# EAGLE design base (EAGLE 5.10)
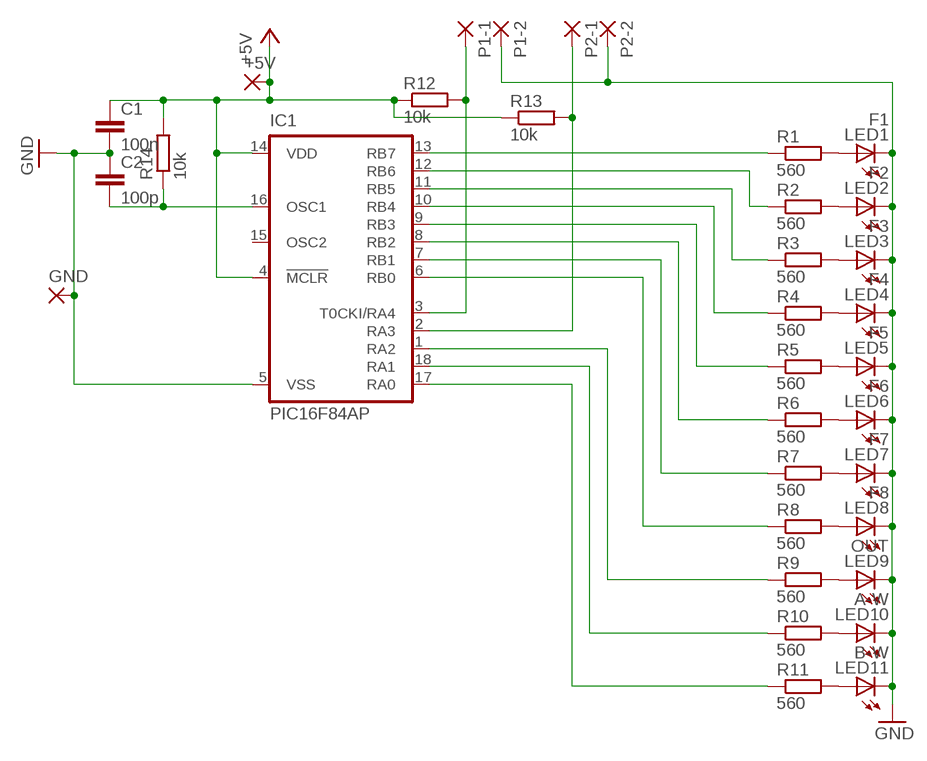
[diagram p0: schematic, sheet 1]

## Parts
+5V  2,54/1,0  [2,54/1,0]
C1  100n  C-EU050-025X075  [C050-025X075]
C2  100p  C-EU050-025X075  [C050-025X075]
GND  2,54/1,0  [2,54/1,0]
IC1  PIC16F84AP  [DIL18]
LED1  F1  LED5MM  [LED5MM]
LED2  F2  LED5MM  [LED5MM]
LED3  F3  LED5MM  [LED5MM]
LED4  F4  LED5MM  [LED5MM]
LED5  F5  LED5MM  [LED5MM]
LED6  F6  LED5MM  [LED5MM]
LED7  F7  LED5MM  [LED5MM]
LED8  F8  LED5MM  [LED5MM]
LED9  OUT  LED5MM  [LED5MM]
LED10  A-W  LED5MM  [LED5MM]
LED11  B-W  LED5MM  [LED5MM]
P1-1  WIREPAD2,54/1,0  [2,54/1,0]
P1-2  WIREPAD2,54/1,0  [2,54/1,0]
P2-1  WIREPAD2,54/1,0  [2,54/1,0]
P2-2  WIREPAD2,54/1,0  [2,54/1,0]
R1  560  R-EU_0204/2V  [0204V]
R2  560  R-EU_0204/2V  [0204V]
R3  560  R-EU_0204/2V  [0204V]
R4  560  R-EU_0204/2V  [0204V]
R5  560  R-EU_0204/2V  [0204V]
R6  560  R-EU_0204/2V  [0204V]
R7  560  R-EU_0204/2V  [0204V]
R8  560  R-EU_0204/2V  [0204V]
R9  560  R-EU_0207/7  [0207/7]
R10  560  R-EU_0207/7  [0207/7]
R11  560  R-EU_0207/7  [0207/7]
R12  10k  R-EU_0204/2V  [0204V]
R13  10k  R-EU_0204/2V  [0204V]
R14  10k  R-EU_0204/2V  [0204V]

## Nets
+5V: +5V.1(P) C1.1 IC1.4(!MCLR) IC1.14(VDD) R12.1 R13.1 R14.2
GND: C1.2 C2.1 GND.1(P) IC1.5(VSS) LED1.K(C) LED2.K(C) LED3.K(C) LED4.K(C) LED5.K(C) LED6.K(C) LED7.K(C) LED8.K(C) LED9.K(C) LED10.K(C) LED11.K(C) P1-2.1(P) P2-2.1(P)
N$1: LED1.A R1.2
N$2: LED2.A R2.2
N$3: LED3.A R3.2
N$4: LED4.A R4.2
N$5: LED5.A R5.2
N$6: LED6.A R6.2
N$7: LED7.A R7.2
N$8: LED8.A R8.2
N$9: LED11.A R11.2
N$10: IC1.13(RB7) R1.1
N$11: IC1.12(RB6) R2.1
N$12: IC1.11(RB5) R3.1
N$13: IC1.10(RB4) R4.1
N$14: IC1.9(RB3) R5.1
N$15: IC1.8(RB2) R6.1
N$16: IC1.7(RB1) R7.1
N$17: IC1.6(RB0) R8.1
N$18: LED9.A R9.2
N$19: LED10.A R10.2
N$20: IC1.1(RA2) R9.1
N$21: IC1.18(RA1) R10.1
N$22: C2.2 IC1.16(OSC1) R14.1
N$23: IC1.17(RA0) R11.1
N$24: IC1.3(T0CKI/RA4) P1-1.1(P) R12.2
N$25: IC1.2(RA3) P2-1.1(P) R13.2
Unconnected: IC1.15(OSC2)

## Library data of the parts
+5V GND = wirepad:2,54/1,0: THROUGH-HOLE PAD
C1 C2 = resistor:C-EU: CAPACITOR, European symbol
IC1 = microchip:PIC16F8*: MICROCONTROLLER 8-Bit PIC16F8X Family - CMOS Flash/EEPROM Pin Compatible : PIC16F83, PIC16CR83, PIC16F84A, PIC16CR84 see also PIC16C*
LED1-LED11 = led:LED: LED OSRAM: - CHIPLED LG R971, LG N971, LY N971, LG Q971, LY Q971, LO R971, LY R971 LH N974, LH R974 LS Q976, LO Q976, LY Q976 LO Q996 - Hyper CHIPLED LW Q18S LB Q993, LB Q99A, LB R99A - SideLED LS A670, LO A670, LY A670, LG A670, LP A670 LB A673, LV A673, LT A673, LW A673 LH A674 LY A675 LS A676, LA A676, LO A676, LY A676, LW A676 LS A679, LY A679, LG A679 - Hyper Micro SIDELED® LS Y876, LA Y876, LO Y876, LY Y876 LT Y87S - SmartLED LW L88C, LW L88S LB L89C, LB L89S, LG L890 LS L89K, LO L89K, LY L89K LS L896, LA L896, LO L896, LY L896 - TOPLED LS T670, LO T670, LY T670, LG T670, LP T670 LSG T670, LSP T670, LSY T670, LOP T670, LYG T670 LG T671, LOG T671, LSG T671 LB T673, LV T673, LT T673, LW T673 LH T674 LS T676, LA T676, LO T676, LY T676, LB T676, LH T676, LSB T676, LW T676 LB T67C, LV T67C, LT T67C, LS T67K, LO T67K, LY T67K, LW E67C LS E67B, LA E67B, LO E67B, LY E67B, LB E67C, LV E67C, LT E67C LW T67C LS T679, LY T679, LG T679 LS T770, LO T770, LY T770, LG T770, LP T770 LB T773, LV T773, LT T773, LW T773 LH T774 LS E675, LA E675, LY E675, LS T675 LS T776, LA T776, LO T776, LY T776, LB T776 LHGB T686 LT T68C, LB T68C - Hyper Mini TOPLED® LB M676 - Mini TOPLED Santana® LG M470 LS M47K, LO M47K, LY M47K Source: http://www.osram.convergy.de LUXEON: - LUMILED® LXK2-PW12-R00, LXK2-PW12-S00, LXK2-PW14-U00, LXK2-PW14-V00 LXK2-PM12-R00, LXK2-PM12-S00, LXK2-PM14-U00 LXK2-PE12-Q00, LXK2-PE12-R00, LXK2-PE12-S00, LXK2-PE14-T00, LXK2-PE14-U00 LXK2-PB12-K00, LXK2-PB12-L00, LXK2-PB12-M00, LXK2-PB14-N00, LXK2-PB14-P00, LXK2-PB14-Q00 LXK2-PR12-L00, LXK2-PR12-M00, LXK2-PR14-Q00, LXK2-PR14-R00 LXK2-PD12-Q00, LXK2-PD12-R00, LXK2-PD12-S00 LXK2-PH12-R00, LXK2-PH12-S00 LXK2-PL12-P00, LXK2-PL12-Q00, LXK2-PL12-R00 Source: www.luxeon.com KINGBRIGHT: KA-3528ASYC Source: www.kingbright.com
P1-1 P1-2 P2-1 P2-2 = wirepad:WIREPAD: Wire PAD connect wire on PCB
R1-R8 = resistor:R-EU_: RESISTOR, European symbol
R9-R14 = rcl:R-EU_: RESISTOR, European symbol

## Board
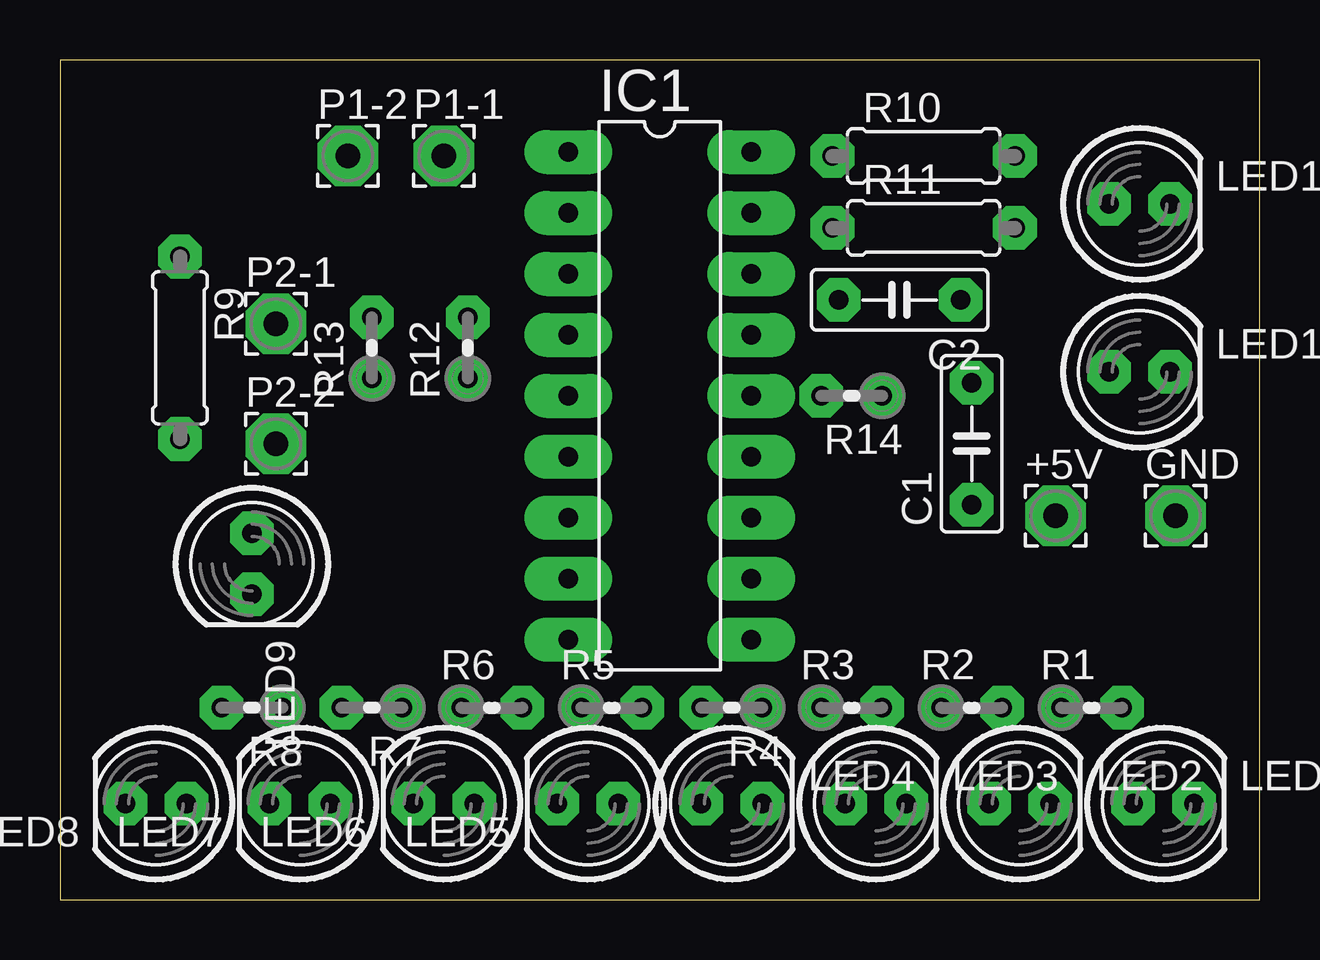
[diagram p1: board, top side]
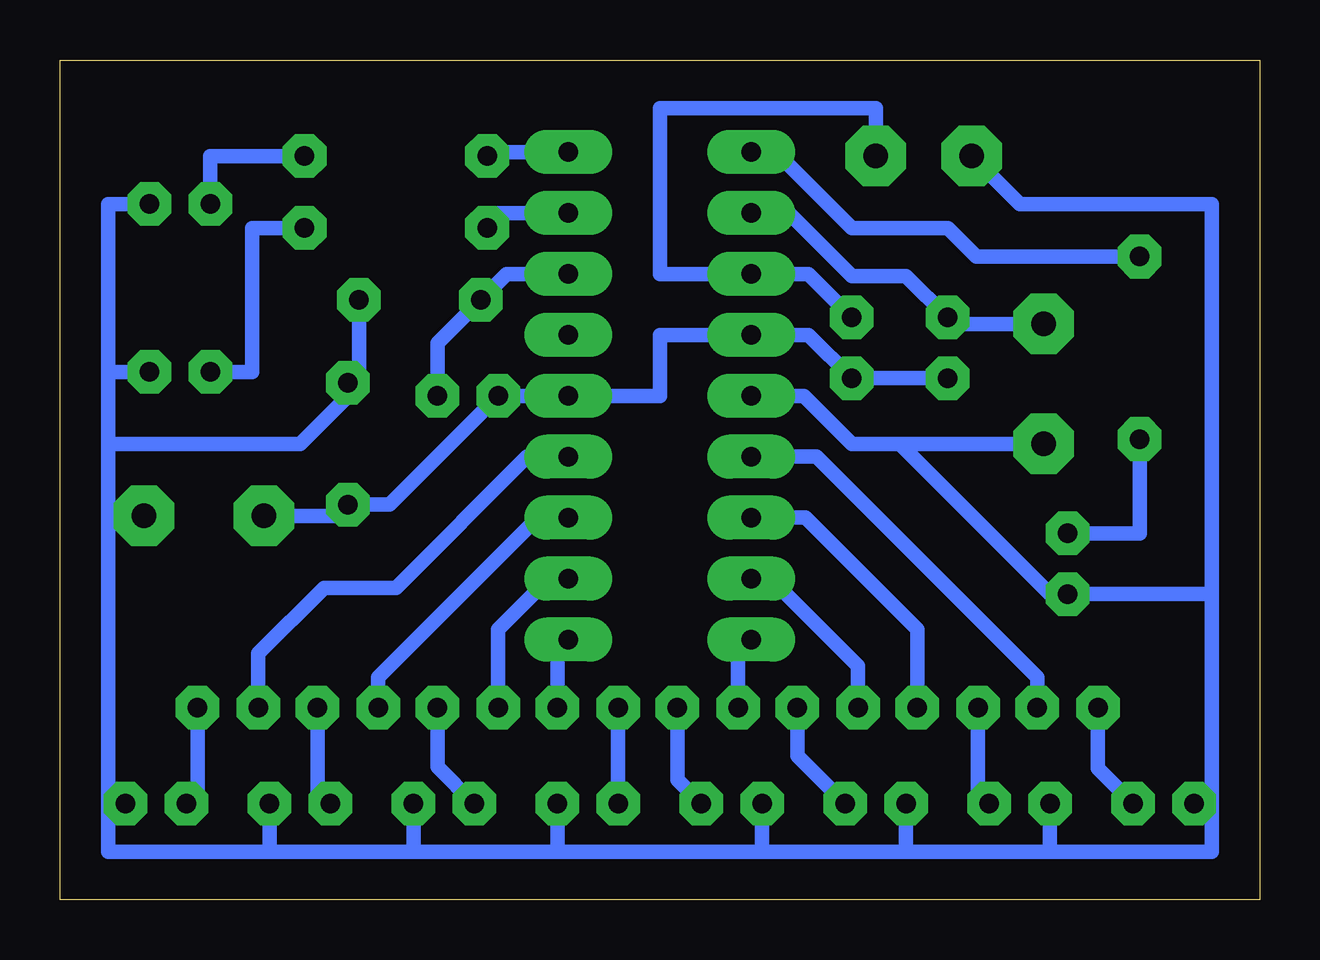
[diagram p2: board, bottom side, seen from below]

Size 50 x 35 mm. Coordinates in mm from the lower left corner, seen from the top.
Outline: 0,0 50,0 50,35 0,35 0,0
Copper layers (1*16): Top 0.035mm / dielectric 1.5mm / Bottom 0.035mm
Design rules "default *": minimum track width 10mil, minimum drill 24mil, track to track 8mil, track to pad 8mil, pad to pad 8mil, via to via 8mil, smd to smd 8mil, copper to edge 40mil, drill to drill 8mil, minimum pad ring 20mil, minimum via ring 8mil, stop-mask expansion 4mil, vias tented up to drill 0mil, thermal gap 10mil

### Footprints (pad centres in the part's own frame; a part is rotated, then mirrored left to right if it is on the bottom)
2,54/1,0 = drill 1.016 pad 2.54 octagon: 1 0,0
C050-025X075 = drill 0.813 octagon: 1 -2.54,0; 2 2.54,0
DIL18 = drill 0.813 long: 1 -10.16,-3.81; 2 -7.62,-3.81; 3 -5.08,-3.81; 4 -2.54,-3.81; 5 0,-3.81; 6 2.54,-3.81; 7 5.08,-3.81; 8 7.62,-3.81; 9 10.16,-3.81; 10 10.16,3.81; 11 7.62,3.81; 12 5.08,3.81; 13 2.54,3.81; 14 0,3.81; 15 -2.54,3.81; 16 -5.08,3.81; 17 -7.62,3.81; 18 -10.16,3.81
LED5MM = drill 0.813 octagon: A -1.27,0; K 1.27,0
0204V = drill 0.813 octagon: 1 -1.27,0; 2 1.27,0
0207/7 = drill 0.813 octagon: 1 -3.81,0; 2 3.81,0

### Placement (x,y rotation side)
+5V  41.5,16 0 top
C1  38,19 90 top
C2  35,25 180 top
GND  46.5,16 0 top
IC1  25,21 270 top
LED1  46,4 0 top
LED2  40,4 0 top
LED3  34,4 0 top
LED4  28,4 0 top
LED5  22,4 180 top
LED6  16,4 180 top
LED7  10,4 180 top
LED8  4,4 180 top
LED9  8,14 270 top
LED10  45,29 0 top
LED11  45,22 0 top
P1-1  16,31 0 top
P1-2  12,31 0 top
P2-1  9,24 0 top
P2-2  9,19 0 top
R1  43,8 0 top
R2  38,8 0 top
R3  33,8 0 top
R4  28,8 180 top
R5  23,8 0 top
R6  18,8 0 top
R7  13,8 180 top
R8  8,8 180 top
R9  5,23 270 top
R10  36,31 0 top
R11  36,28 0 top
R12  17,23 90 top
R13  13,23 90 top
R14  33,21 180 top

### Tracks (layer width: path | path; a pad name or v marks a point on that pad's centre or on a via)
+5V
  Bottom 0.61: R13.1 R12.1 18.81,23.54 IC1.4 25,23.54 25,21 IC1.14 R14.2 36.27,16.46 C1.1 38.46,16 +5V.1
GND
  Bottom 0.61: 8.73,2 2,2 2,4 | 35.27,2 41.27,2 | 48,4 48,2 41.27,2 | 48,4 48,16 | 48,4 LED1.K | 8.73,2 LED7.K | 8.73,2 14.73,2 | 14.73,2 LED6.K | 14.73,2 20.73,2 | 20.73,2 LED5.K | 29.27,2 LED4.K | 20.73,2 29.27,2 | 35.27,2 LED3.K | 29.27,2 35.27,2 | 41.27,2 LED2.K | 48,16 GND.1 | 48,16 48,19 | 48,19 48,22 | 48,22 LED11.K | 48,22 48,29 LED10.K | 2,4 LED8.K | 2,12.73 LED9.K 8.73,12.73 15,19 | 2,4 2,12.73 | 2,12.73 2,29 10,29 P1-2.1 | 15,19 P2-2.1 | 15,19 17,19 19,21 IC1.5 | 48,19 40,19 38,21 C1.2 37.54,22 C2.1
N$1
  Bottom 0.61: R1.2 44.27,4.46 LED1.A
N$2
  Bottom 0.61: R2.2 39.27,4.54 LED2.A
N$3
  Bottom 0.61: R3.2 34.27,5.54 LED3.A
N$4
  Bottom 0.61: R4.2 LED4.A
N$5
  Bottom 0.61: R5.2 24.27,5 LED5.A
N$6
  Bottom 0.61: R6.2 19.27,6 LED6.A
N$7
  Bottom 0.61: R7.2 11.73,4.46 LED7.A
N$8
  Bottom 0.61: R8.2 6.73,5.46 LED8.A
N$9
  Bottom 0.61: R11.2 42,28 42,22 LED11.A
N$10
  Bottom 0.61: IC1.13 30.54,18.46 36,13 39,13 41.73,10.27 R1.1
N$11
  Bottom 0.61: IC1.12 30.08,15.92 36.73,9.27 R2.1
N$12
  Bottom 0.61: IC1.11 29.62,13.38 31.73,11.27 R3.1
N$13
  Bottom 0.61: IC1.10 29.27,10.38 R4.1
N$14
  Bottom 0.61: R5.1 21.73,10.3 IC1.9
N$15
  Bottom 0.61: R6.1 16.73,9.73 20,13 20.81,13 IC1.8
N$16
  Bottom 0.61: R7.1 14.27,11.27 18.92,15.92 IC1.7
N$17
  Bottom 0.61: R8.1 9.27,9.27 18.46,18.46 IC1.6
N$18
  Bottom 0.61: LED9.A 5,15.27 R9.2
N$19
  Bottom 0.61: R10.2 43.73,31 LED10.A
N$20
  Bottom 0.61: R9.1 11.81,26.81 13,28 17,28 20,31 21.03,31 IC1.1
N$21
  Bottom 0.61: R10.1 32.19,31.16 IC1.18
N$22
  Bottom 0.61: R14.1 34.27,23.19 C2.2 31.38,26.08 IC1.16
N$23
  Bottom 0.61: R11.1 32.19,28.62 IC1.17
N$24
  Bottom 0.61: P1-1.1 16,33 25,33 25,26.08 IC1.3 18.81,26.08 R12.2
N$25
  Bottom 0.61: IC1.2 19.62,28.62 17,26 14.73,26 R13.2 12.73,24 P2-1.1